# EAGLE design TI74_RAM (EAGLE 7.7.0)
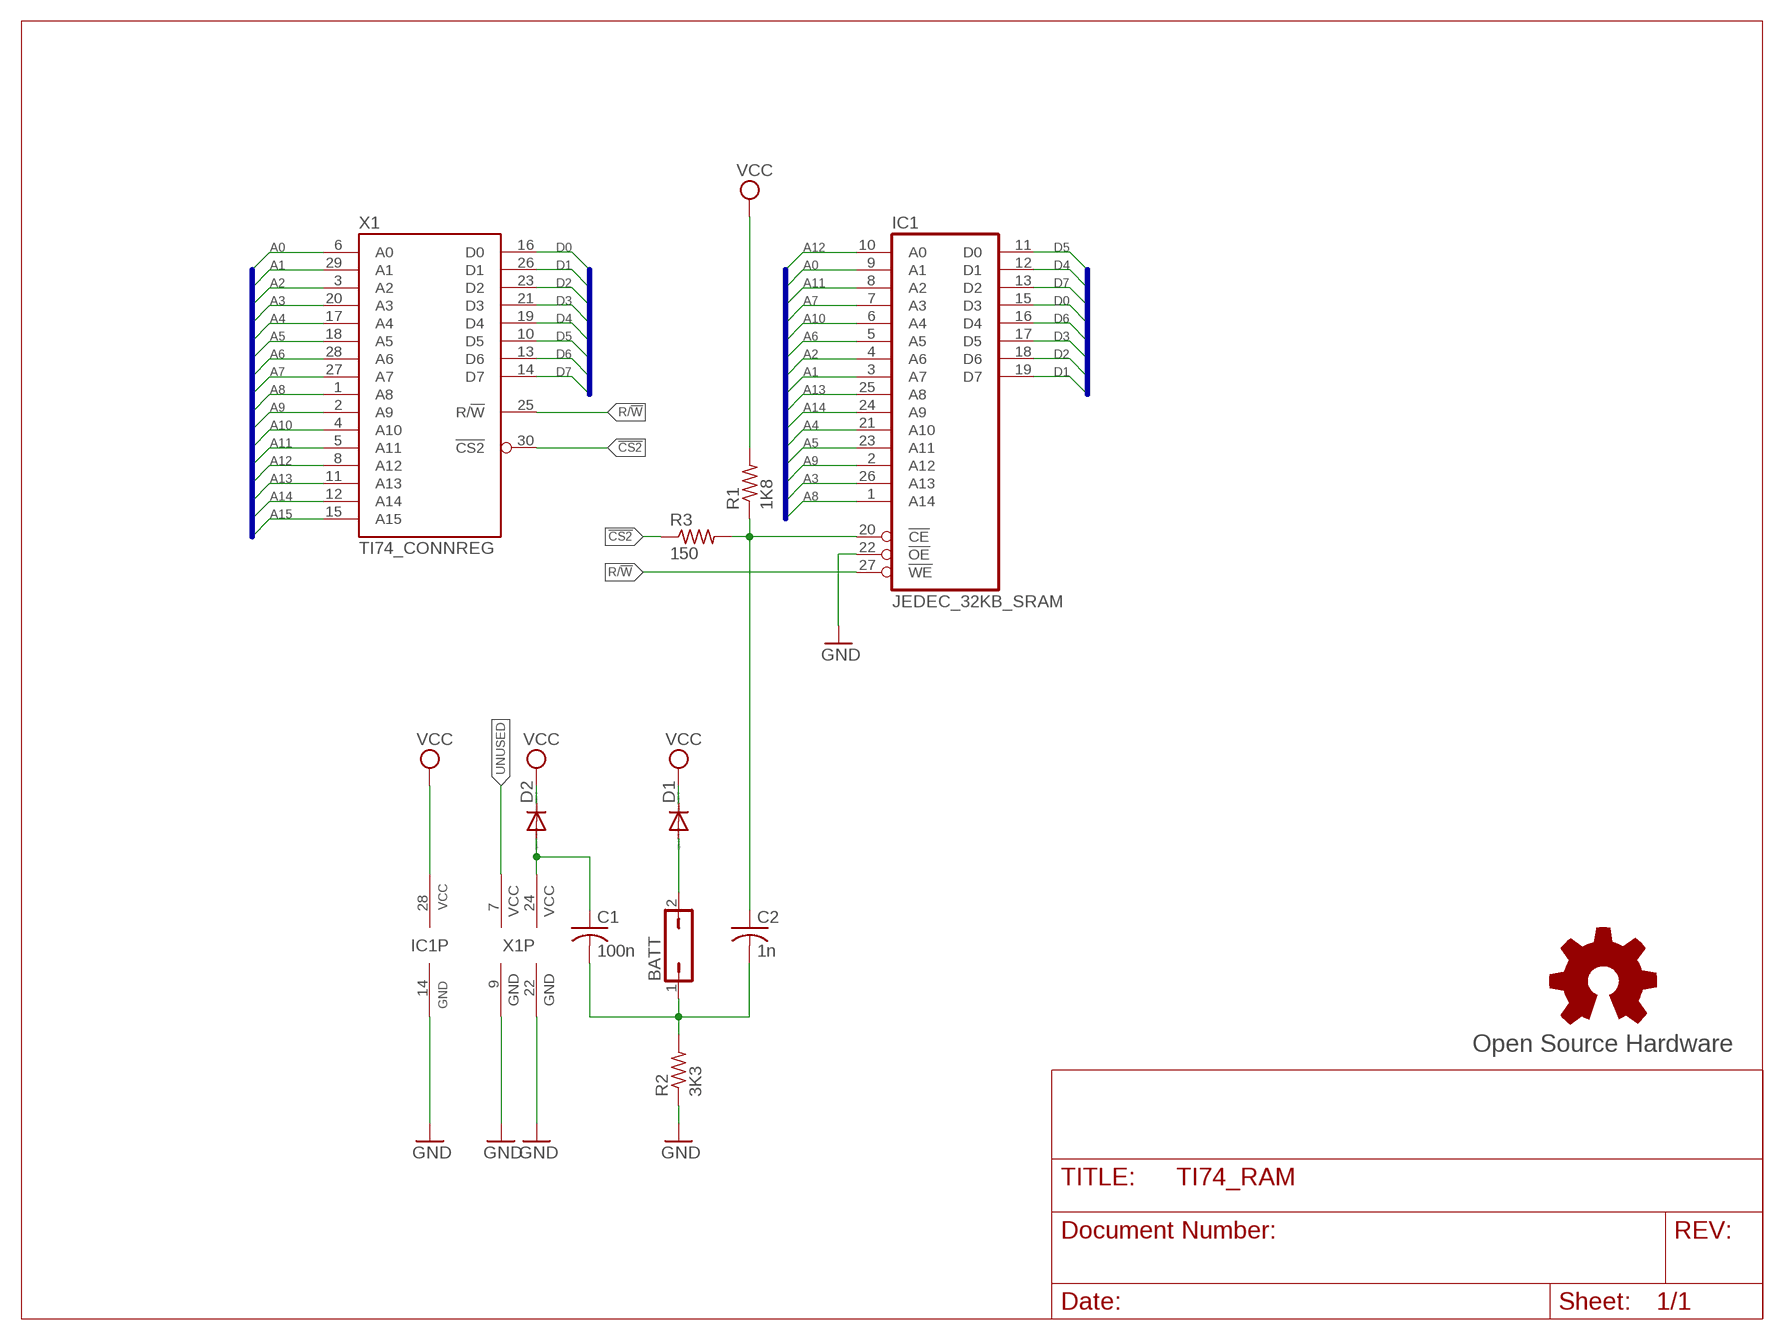
[diagram p0: schematic, sheet 1]

## Parts
BATT  JP1Q  [JP1]
C1  100n  C-USC0603  [C0603]
C2  1n  C-USC0603  [C0603]
D1  DIODE-SOD323-W  [SOD323-W]
D2  DIODE-SOD323-W  [SOD323-W]
GOLD_ORB_SM1  Open Source Hardware  OSHWLOGOLOGO5MM  [OSHW_5MM]
IC1  JEDEC_32KB_SRAM  [SO28L]
R1  1K8  R-US_R0603  [R0603]
R2  3K3  R-US_R0603  [R0603]
R3  150  R-US_R0603  [R0603]
X1  TI74_CONNREG  [MA050-15-2SHORT]

## Nets
!CS2: R3.1 X1.30(!CS2)
A0: IC1.9(A1) X1.6(A0)
A1: IC1.3(A7) X1.29(A1)
A2: IC1.4(A6) X1.3(A2)
A3: IC1.26(A13) X1.20(A3)
A4: IC1.21(A10) X1.17(A4)
A5: IC1.23(A11) X1.18(A5)
A6: IC1.5(A5) X1.28(A6)
A7: IC1.7(A3) X1.27(A7)
A8: IC1.1(A14) X1.1(A8)
A9: IC1.2(A12) X1.2(A9)
A10: IC1.6(A4) X1.4(A10)
A11: IC1.8(A2) X1.5(A11)
A12: IC1.10(A0) X1.8(A12)
A13: IC1.25(A8) X1.11(A13)
A14: IC1.24(A9) X1.12(A14)
A15: X1.15(A15)
D0: IC1.15(D3) X1.16(D0)
D1: IC1.19(D7) X1.26(D1)
D2: IC1.18(D6) X1.23(D2)
D3: IC1.17(D5) X1.21(D3)
D4: IC1.12(D1) X1.19(D4)
D5: IC1.11(D0) X1.10(D5)
D6: IC1.16(D4) X1.13(D6)
D7: IC1.13(D2) X1.14(D7)
GND: IC1.14(GND) IC1.22(!OE) R2.1 X1.9(GND) X1.22(GND)
N$1: C2.1 IC1.20(!CE) R1.1 R3.2
N$2: C1.1 D2.A X1.24(VCC_RAM)
N$3: BATT.2 D1.A
N$4: BATT.1 C1.2 C2.2 R2.2
R/!W: IC1.27(!WE) X1.25(R/!W)
UNUSED: X1.7(VCC)
VCC: D1.C D2.C IC1.28(VCC) R1.2

## Buses
A[0..15]
D[0..7]

## Library data of the parts
BATT = jumper-jlb:JP1Q: JUMPER
C1 C2 = resistor:C-US: CAPACITOR, American symbol
D1 D2 = diode:DIODE-: DIODE
GOLD_ORB_SM1 = oshw:OSHWLOGO: The OSHW logo for PCB layout
IC1 = memory-jedec-jlb:JEDEC_32KB_SRAM: MEMORY; MPN: CY62256VNLL-70SNXI; OC_FARNELL: 1650073; OC_NEWARK: 19M2582
R1-R3 = resistor:R-US_: RESISTOR, American symbol
X1 = ti74:TI74_CONN

## Board
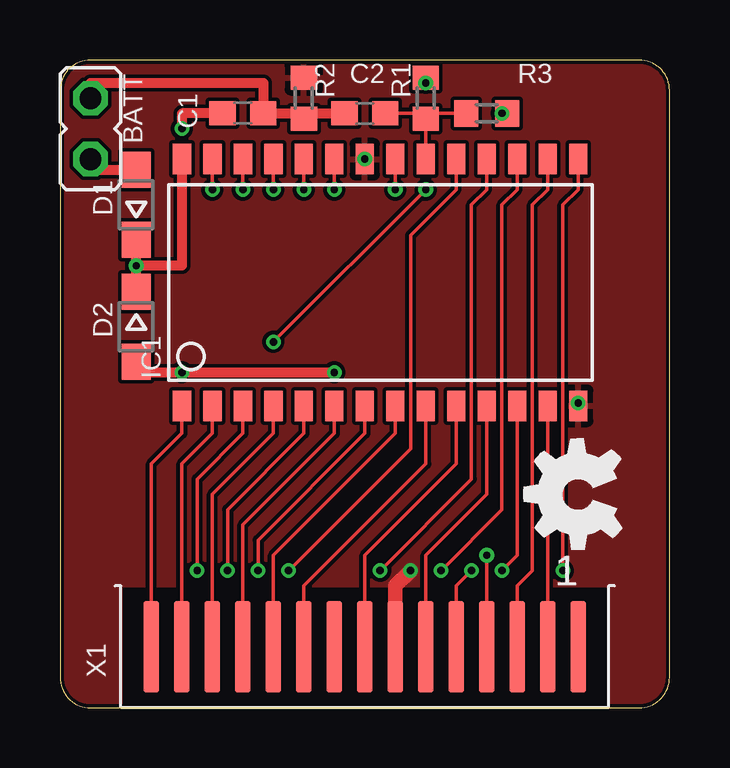
[diagram p1: board, top side]
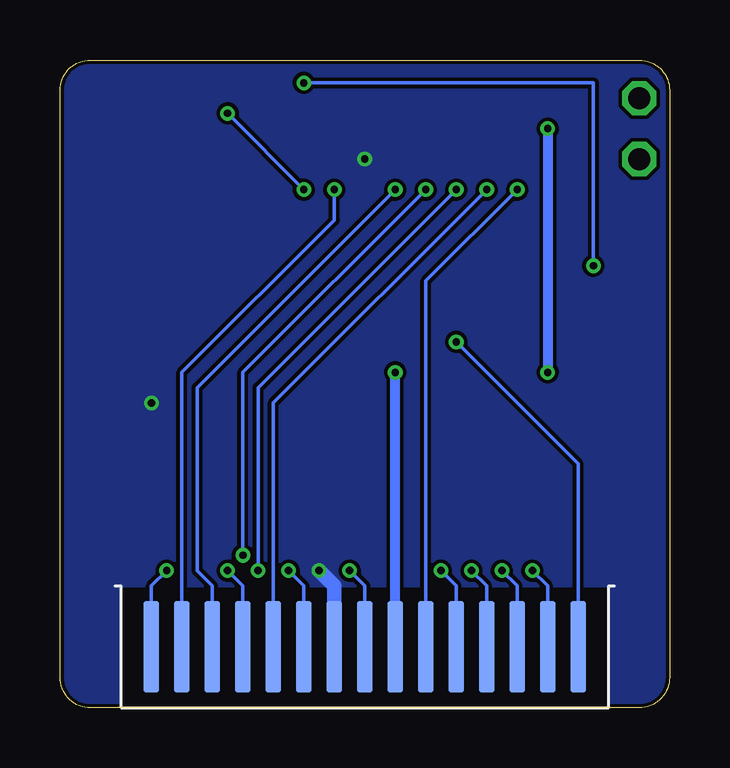
[diagram p2: board, bottom side, seen from below]

Size 25.4 x 26.99 mm. Coordinates in mm from the lower left corner, seen from the top.
Outline: 0,25.72 0,1.27 arc90 1.27,0 24.13,0 arc90 25.4,1.27 25.4,25.72 arc90 24.13,26.99 1.27,26.99 arc90 0,25.72
Copper layers (1*16): Top 0.035mm / dielectric 1.5mm / Bottom 0.035mm
Design rules "hackvana": minimum track width 6mil, minimum drill 0.3mm, track to track 6mil, track to pad 6mil, pad to pad 6mil, via to via 6mil, smd to smd 0mil, copper to edge 6mil, drill to drill 6mil, minimum pad ring 10mil, minimum via ring 6mil, stop-mask expansion 2mil, vias tented up to drill 100mil, thermal gap 10mil

### Footprints (pad centres in the part's own frame; a part is rotated, then mirrored left to right if it is on the bottom)
JP1 = drill 0.914 octagon: 1 0,-1.27; 2 0,1.27
C0603 = smd 1.1 x 1: 1 -0.85,0; 2 0.85,0
SOD323-W = smd 1.5 x 1.2: A 1.45,0; C -1.45,0
SO28L = smd 0.762 x 1.27: 1 -7.62,-5.207; 2 -6.35,-5.207; 3 -5.08,-5.207; 4 -3.81,-5.207; 5 -2.54,-5.207; 6 -1.27,-5.207; 7 0,-5.207; 8 1.27,-5.207; 9 2.54,-5.207; 10 3.81,-5.207; 11 5.08,-5.207; 12 6.35,-5.207; 13 7.62,-5.207; 14 8.89,-5.207; 15 8.89,5.08; 16 7.62,5.08; 17 6.35,5.08; 18 5.08,5.08; 19 3.81,5.08; 20 2.54,5.08; 21 1.27,5.08; 22 0,5.08; 23 -1.27,5.08; 24 -2.54,5.08; 25 -3.81,5.08; 26 -5.08,5.08; 27 -6.35,5.08; 28 -7.62,5.08
R0603 = smd 1 x 1.1: 1 -0.85,0; 2 0.85,0
MA050-15-2SHORT = smd 0.635 x 3.81: 1 8.89,0; 2 7.62,0; 3 6.35,0; 4 5.08,0; 5 3.81,0; 6 2.54,0; 7 1.27,0; 8 0,0; 9 -1.27,0; 10 -2.54,0; 11 -3.81,0; 12 -5.08,0; 13 -6.35,0; 14 -7.62,0; 15 -8.89,0 | smd 0.635 x 3.81 bottom: 16 -8.89,0; 17 -7.62,0; 18 -6.35,0; 19 -5.08,0; 20 -3.81,0; 21 -2.54,0; 22 -1.27,0; 23 0,0; 24 1.27,0; 25 2.54,0; 26 3.81,0; 27 5.08,0; 28 6.35,0; 29 7.62,0; 30 8.89,0

### Placement (x,y rotation side)
BATT  1.27,24.13 180 top
C1  7.62,24.77 0 top
C2  12.7,24.77 180 top
D1  3.17,20.95 90 top
D2  3.17,15.88 270 top
GOLD_ORB_SM1  21.59,8.89 90 top
IC1  12.7,17.78 0 top
R1  15.24,25.4 90 top
R2  10.16,25.4 270 top
R3  17.78,24.77 180 top
X1  12.7,2.54 180 top

### Tracks (layer width: path | path; a pad name or v marks a point on that pad's centre or on a via)
!CS2  (via drill 0.3)
  Top 0.152: v18.41,24.77 R3.1 | v15.24,21.59 v8.89,15.24
  Bottom 0.152: X1.30 3.81,10.16 v8.89,15.24 | v15.24,21.59 v18.41,24.77
A0
  Top 0.152: X1.6 10.16,5.08 15.24,10.16 IC1.9
A1  (via drill 0.3)
  Top 0.152: v5.71,5.71 5.71,9.53 7.62,11.43 IC1.3
  Bottom 0.152: X1.29 5.08,5.08 v5.71,5.71
A2
  Top 0.152: X1.3 6.35,8.89 8.89,11.43 IC1.4
A3  (via drill 0.3)
  Top 0.152: v7.62,21.59 IC1.26
  Bottom 0.152: X1.20 16.51,12.7 v7.62,21.59
A4  (via drill 0.3)
  Top 0.152: v13.97,21.59 IC1.21
  Bottom 0.152: X1.17 20.32,13.97 13.97,20.32 v13.97,21.59
A5  (via drill 0.3)
  Top 0.152: v11.43,21.59 IC1.23
  Bottom 0.152: X1.18 19.05,5.08 19.68,5.71 19.68,13.34 v11.43,21.59
A6  (via drill 0.3)
  Top 0.152: IC1.5 10.16,11.43 6.98,8.26 v6.98,5.71
  Bottom 0.152: X1.28 6.35,5.08 v6.98,5.71
A7  (via drill 0.3)
  Top 0.152: IC1.7 12.7,11.43 8.25,6.99 v8.25,5.71
  Bottom 0.152: X1.27 7.62,5.08 v8.25,5.71
A8
  Top 0.152: X1.1 3.81,10.16 5.08,11.43 IC1.1
A9
  Top 0.152: X1.2 5.08,10.16 6.35,11.43 IC1.2
A10
  Top 0.152: X1.4 7.62,7.62 11.43,11.43 IC1.6
A11
  Top 0.152: X1.5 8.89,6.35 13.97,11.43 IC1.8
A12
  Top 0.152: X1.8 12.7,6.35 16.51,10.16 IC1.10
A13  (via drill 0.3)
  Top 0.152: X1.11 16.51,5.08 v17.14,5.71 | v8.89,21.59 IC1.25
  Bottom 0.152: v17.14,5.71 17.14,13.34 v8.89,21.59
A14  (via drill 0.3)
  Top 0.152: X1.12 v17.78,6.35 | v10.16,21.59 IC1.24
  Bottom 0.152: v17.78,6.35 17.78,13.97 v10.16,21.59
D0  (via drill 0.3)
  Top 0.152: v20.95,5.71 20.95,20.95 21.59,21.59 IC1.15
  Bottom 0.152: X1.16 21.59,5.08 v20.95,5.71
D1  (via drill 0.3)
  Top 0.152: v9.52,5.71 14.6,10.79 14.6,19.68 16.51,21.59 IC1.19
  Bottom 0.152: X1.26 8.89,5.08 v9.52,5.71
D2  (via drill 0.3)
  Top 0.152: v13.33,5.71 17.14,9.53 17.14,20.95 17.78,21.59 IC1.18
  Bottom 0.152: X1.23 12.7,5.08 v13.33,5.71
D3  (via drill 0.3)
  Top 0.152: v15.88,5.71 18.41,8.26 18.41,20.95 19.05,21.59 IC1.17
  Bottom 0.152: X1.21 15.24,5.08 v15.88,5.71
D4  (via drill 0.3)
  Top 0.152: v18.41,5.71 19.05,6.35 IC1.12
  Bottom 0.152: X1.19 17.78,5.08 v18.41,5.71
D5
  Top 0.152: X1.10 15.24,6.35 17.78,8.89 IC1.11
D6
  Top 0.152: X1.13 19.05,5.08 19.68,5.71 19.68,20.95 20.32,21.59 IC1.16
D7
  Top 0.152: X1.14 IC1.13
GND  (via drill 0.3)
  Top 0.61: X1.9 13.97,5.08 v14.6,5.71
  Bottom 0.61: v14.6,5.71 13.97,5.08 X1.9
  other vias: 12.7,22.86 21.59,12.7
  pour Bottom: 2.54,0 1.27,0 arc-90 0,1.27 0,25.72 arc-90 1.27,26.99 24.13,26.99 arc-90 25.4,25.72 25.4,1.27 arc-90 24.13,0 22.86,0 22.86,5.08 2.54,5.08
  pour Top: 2.54,0 1.27,0 arc-90 0,1.27 0,25.72 arc-90 1.27,26.99 24.13,26.99 arc-90 25.4,25.72 25.4,1.27 arc-90 24.13,0 22.86,0 22.86,5.08 2.54,5.08
N$1
  Top 0.152: IC1.20 R1.1 | R1.1 15.45,24.77 R3.2 | R1.1 15.02,24.77 C2.1
N$2  (via drill 0.3)
  Top 0.406: 3.17,14.61 D2.A 3.17,13.97 v5.08,13.97 v11.43,13.97 | C1.1 5.08,24.77 v5.08,24.13
  Bottom 0.406: X1.24 v11.43,13.97 | v5.08,24.13 v5.08,13.97
N$3
  Top 0.406: BATT.2 1.27,22.41 D1.A
N$4
  Top 0.406: 10.16,24.77 C1.2 8.47,26.04 1.27,26.04 BATT.1 | 10.16,24.77 C2.2 | R2.2 10.16,24.77
R/!W  (via drill 0.3)
  Top 0.152: v6.35,21.59 IC1.27
  Bottom 0.152: X1.25 10.16,17.78 v6.35,21.59
VCC  (via drill 0.3)
  Top 0.152: R1.2 v15.24,26.04
  Top 0.406: IC1.28 5.08,18.41 v3.17,18.41 | v3.17,18.41 D1.C | D2.C v3.17,18.41
  Bottom 0.152: v15.24,26.04 3.17,26.04 v3.17,18.41